# EAGLE design musIR-tiny-mk-1.0.4 (EAGLE 7.5.0)
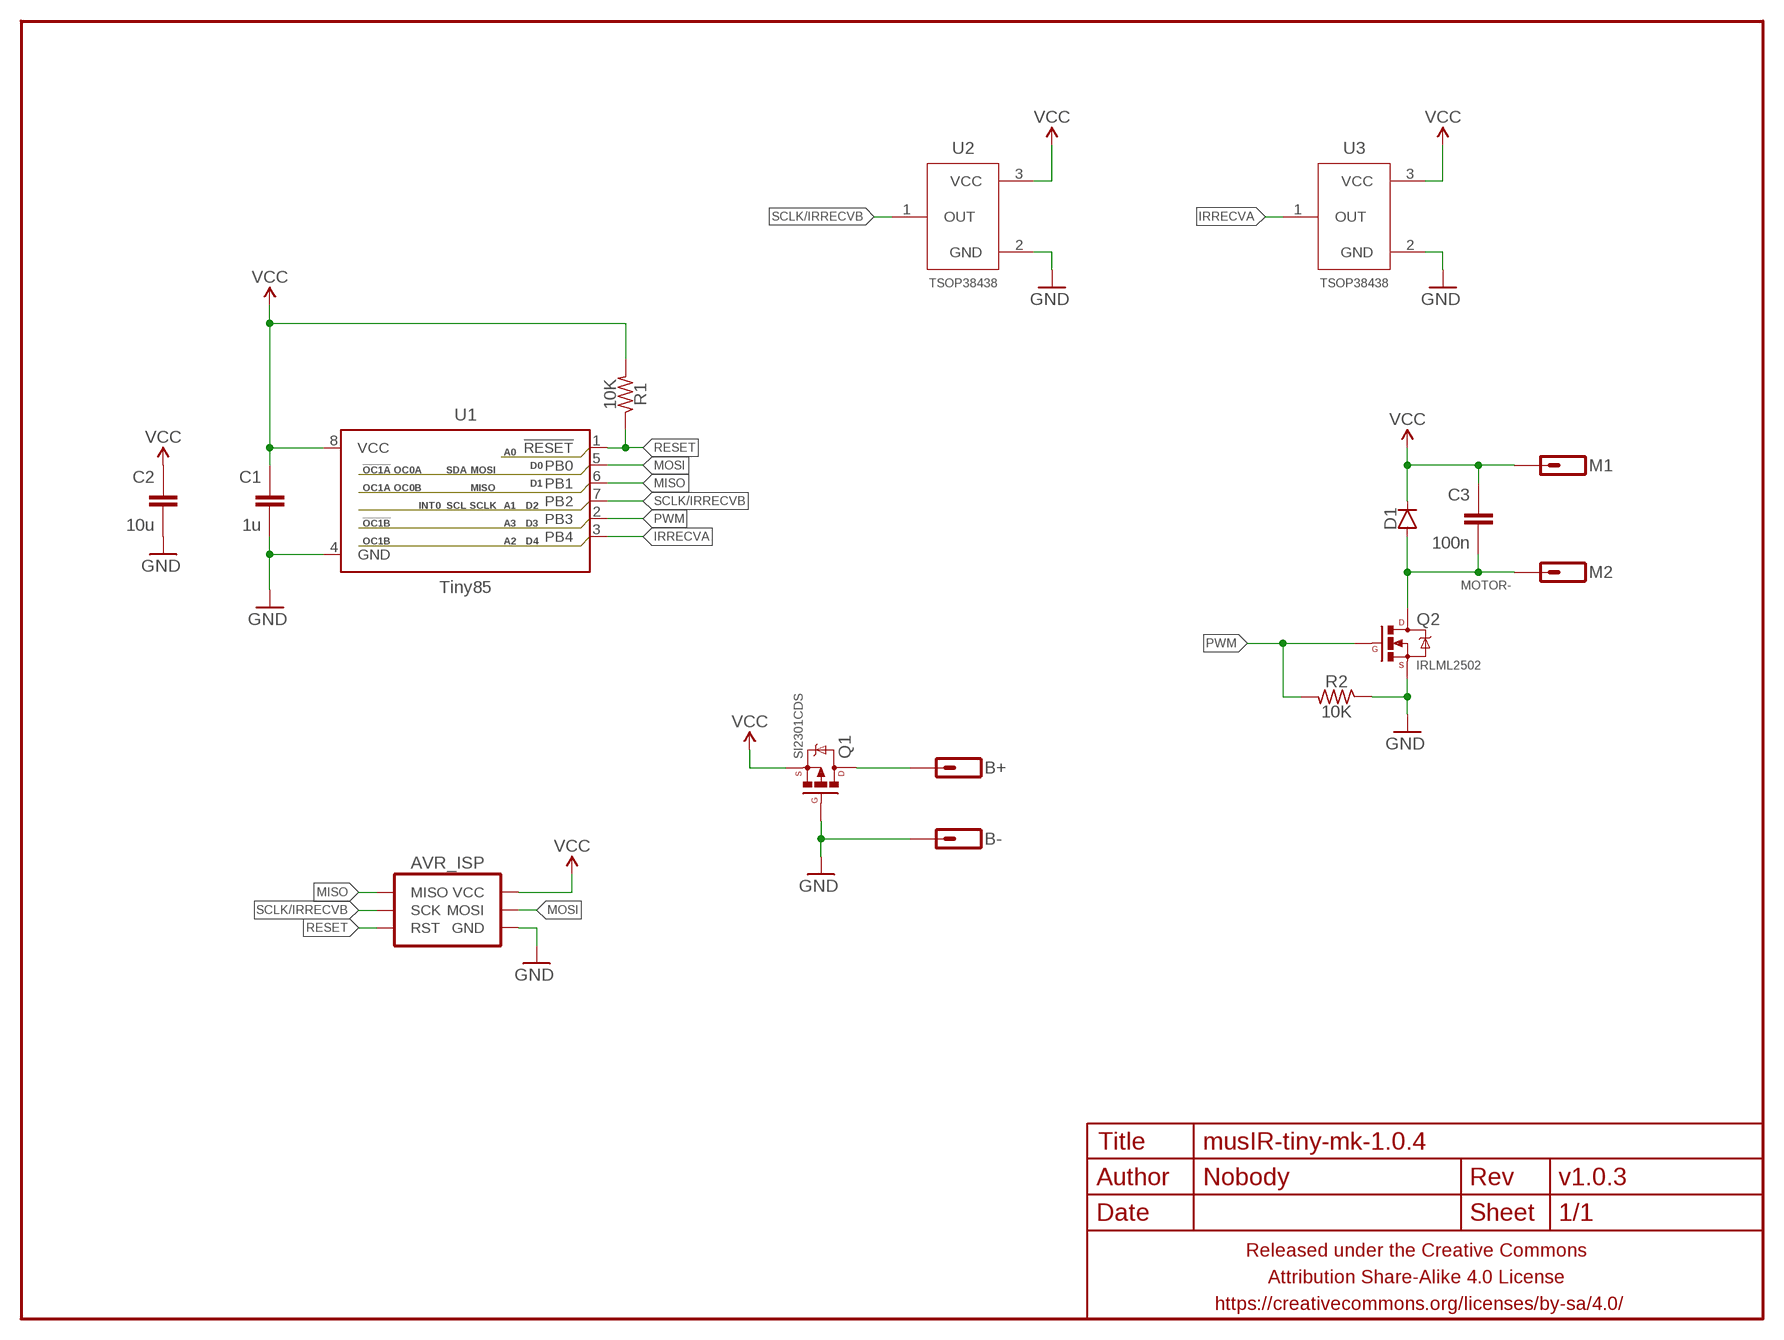
[diagram p0: schematic, sheet 1]

## Parts
AVR_ISP  AVR_SPI_PRG_6TESTPOINTS  [2X3_TEST_POINTS]
B+  M01PTH  [1X01]
B-  M01PTH  [1X01]
C1  1u  CAPACITOR-CERAMICC0603-TIGHTER  [C0603-TIGHTER]
C2  10u  CAPACITOR-CERAMICC0805-TIGHTER  [C0805-TIGHTER]
C3  100n  CAPACITOR-CERAMICC0603-TIGHTER  [C0603-TIGHTER]
D1  DIODESOD123  [SOD123]
FRAME1  FRAME-LETTERNO_PACKAGE  [DUMMY]
M1  M01PTH  [1X01]
M2  M01PTH  [1X01]
Q1  SI2301CDS  MOSFET-PCHANNELSOT-23  [SOT23]
Q2  IRLML2502  MOSFET-NCHANNELIRLML2502  [SOT23]
R1  10K  RESISTORR0603-TIGHTER  [R0603-TIGHTER]
R2  10K  RESISTORR0603-TIGHTER  [R0603-TIGHTER]
U1  Tiny85  ATTINY45TINY85-20-SOICW  [SO08-EIAJ]
U2  TSOP38438  TSOP382__/4__  [TSOP38238]
U3  TSOP38438  TSOP382__/4__  [TSOP38238]

## Nets
GND: AVR_ISP.6(GND) B-.1 C1.2 C2.2 Q1.1(G) Q2.2(S) R2.1 U1.4(GND) U2.2(GND) U3.2(GND)
IRRECVA: U1.3(PB4) U3.1(OUT)
MISO: AVR_ISP.1(MISO) U1.6(PB1)
MOSI: AVR_ISP.4(MOSI) U1.5(PB0)
MOTOR-: C3.2 D1.A M2.1 Q2.3(D)
N$1: B+.1 Q1.3(D)
PWM: Q2.1(G) R2.2 U1.2(PB3)
RESET: AVR_ISP.5(RST) R1.1 U1.1(!RESET)
SCLK/IRRECVB: AVR_ISP.3(SCK) U1.7(PB2) U2.1(OUT)
VCC: AVR_ISP.2(VCC) C1.1 C2.1 C3.1 D1.C M1.1 Q1.2(S) R1.2 U1.8(VCC) U2.3(VCC) U3.3(VCC)

## Library data of the parts
AVR_ISP = a_parts:AVR_SPI_PRG_6: AVR ISP 6 Pin This is the reduced ISP connector for AVR programming. Common on Arduino. This footprint will take up less PCB space and can be used with a 10-pin to 6-pin adapter such as SKU: BOB-08508 **Special note about "TEST_POINT" package. The stop mask is on the top side, so if you want your programming test points to be on the bottom of your board, make sure to place this package on the bottom side of the board. This also ensure that the orientation to program from the bottom side will be correct.
B+ B- M1 M2 = a_parts:M01: Header 1 Standard 1-pin 0.1" header. Use with straight break away headers (SKU : PRT-00116), right angle break away headers (PRT-00553), swiss pins (PRT-00743), machine pins (PRT-00117), and female headers (PRT-00115).
C1-C3 = a_parts:CAPACITOR-CERAMIC: CAPACITOR, European symbol
D1 = a_parts:DIODE: Diode These are standard reverse protection diodes and small signal diodes. SMA package can handle up to about 1A. SOD-323 can handle about 200mA. What the SOD-323 package when ordering, there are some mfgs out there that are 5-pin packages.
FRAME1 = a_parts:FRAME-LETTER: Schematic Frame Standard 8.5x11 US Letter frame; DESIGNER: Nobody; VERSION: v1.0.3
Q1 = a_parts:MOSFET-PCHANNEL: Generic PMOSFET IRLML2244 - TRANS-11153 (SOT-23 -20V -4.3A) (1.Gate 2.Source 3.Drain) FQP27P06 - COM-10349 <http://www.sparkfun.com/products/10349> (TO-220 -60V -27A) (1.Gate 2.Source 3.Drain)
Q2 = a_parts:MOSFET-NCHANNEL: Common NMOSFET Parts MFG P/N Store ID Prod ID FDD8780 TRANS-09984 SI7820DN TRANS-11055 FDS6630A IC-08089 2N7002PW TRANS-11151 FQP30N06L COM-10213 TRANS-10060 BSS123LT1G TRANS-08345 BSS138 TRANS-00830 BS170 2N7000
R1 R2 = a_parts:RESISTOR: RESISTOR, American symbol
U1 = a_parts:ATTINY45: Atmel 8-pin 2/4/8kB flash uC; PROD_ID: IC-09092; VALUE: Tiny85-20-SMT
U2 U3 = a_parts:TSOP382__/4__

## Board
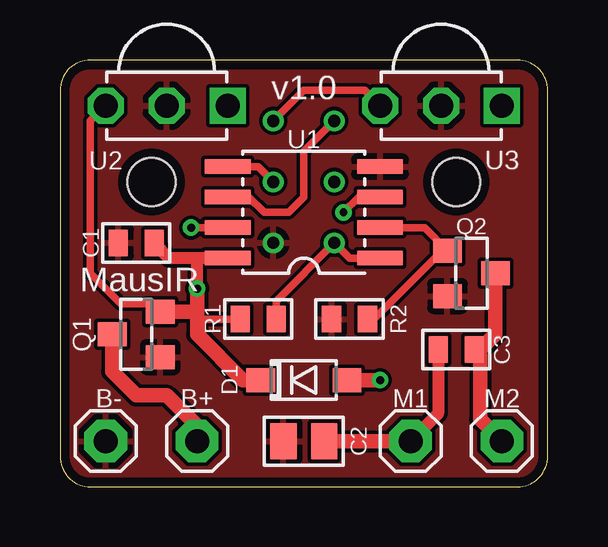
[diagram p1: board, top side]
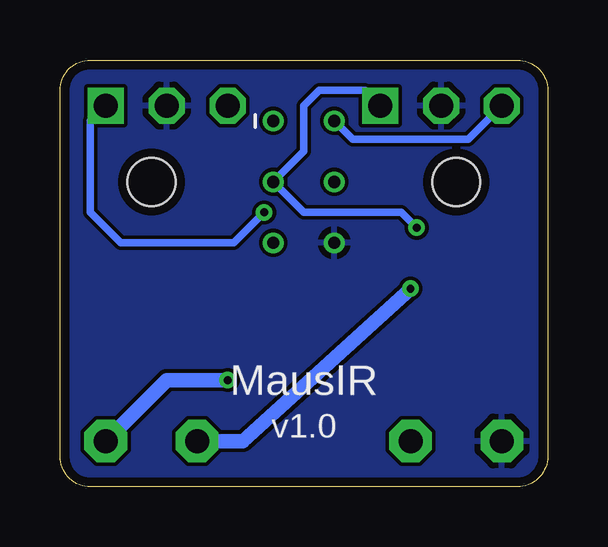
[diagram p2: board, bottom side, seen from below]

Size 20.32 x 17.78 mm. Coordinates in mm from the lower left corner, seen from the top.
Outline: 0,16.51 0,1.27 arc90 1.27,0 19.05,0 arc90 20.32,1.27 20.32,16.51 arc90 19.05,17.78 1.27,17.78 arc90 0,16.51
Copper layers (1*16): Top 0.0356mm / dielectric 1.5011mm / Bottom 0.0356mm
Design rules "LaenPCBOrder2": minimum track width 6mil, minimum drill 13mil, track to track 6mil, track to pad 6mil, pad to pad 6mil, via to via 6mil, smd to smd 6mil, copper to edge 15mil, drill to drill 6mil, minimum pad ring 7mil, minimum via ring 7mil, stop-mask expansion 3mil, vias tented up to drill 20mil, thermal gap 10mil
Holes 2 mm at 3.81,12.7 16.51,12.7

### Footprints (pad centres in the part's own frame; a part is rotated, then mirrored left to right if it is on the bottom)
2X3_TEST_POINTS = drill 0.508: 1 -2.54,-1.27; 2 -2.54,1.27; 3 0,-1.27; 4 0,1.27; 5 2.54,-1.27; 6 2.54,1.27
1X01 = drill 1 pad 1.778 octagon: 1 0,0
C0603-TIGHTER = smd 0.8 x 1.1: 1 -0.75,0; 2 0.75,0
C0805-TIGHTER = smd 1.1 x 1.5: 1 -0.85,0; 2 0.85,0
SOD123 = smd 1.2 x 1: A -1.8,0; C 1.8,0
SOT23 = smd 1 x 1.2: 1 -0.95,-1; 2 0.95,-1; 3 0,1
R0603-TIGHTER = smd 0.8 x 1.1: 1 -0.75,0; 2 0.75,0
SO08-EIAJ = smd 0.61 x 1.905: 1 -1.905,-3.175; 2 -0.635,-3.175; 3 0.635,-3.175; 4 1.905,-3.175; 5 1.905,3.175; 6 0.635,3.175; 7 -0.635,3.175; 8 -1.905,3.175
TSOP38238 = drill 1 square: 1 -2.54,0 | drill 1 octagon: 2 0,0; 3 2.54,0

### Placement (x,y rotation side)
AVR_ISP  10.16,12.7 270 bottom
B+  5.71,1.91 270 top
B-  1.91,1.91 90 top
C1  3.17,10.16 180 top
C2  10.16,1.91 180 top
C3  16.51,5.71 0 top
D1  10.16,4.45 180 top
FRAME1  0,0 0 top
M1  14.61,1.91 0 top
M2  18.41,1.91 0 top
Q1  3.17,6.35 90 top
Q2  17.14,8.89 270 top
R1  8.26,6.99 180 top
R2  12.06,6.99 0 top
U1  10.16,11.43 90 top
U2  4.45,15.88 180 top
U3  15.88,15.88 180 top

### Tracks (layer width: path | path; a pad name or v marks a point on that pad's centre or on a via)
GND
  pour Top (rank 6): 0,16.51 0,1.27 arc90 1.27,0 19.05,0 arc90 20.32,1.27 20.32,16.51 arc90 19.05,17.78 1.27,17.78 arc90
  pour Bottom (rank 6): 0,16.51 0,1.27 arc90 1.27,0 19.05,0 arc90 20.32,1.27 20.32,16.51 arc90 19.05,17.78 1.27,17.78 arc90
IRRECVA  (via drill 0.33)
  Top 0.305: U1.3 12.45,12.06 v11.81,11.43
  Bottom 0.305: v11.81,11.43 13.08,10.16 17.78,10.16 19.05,11.43 19.05,15.24 U3.1
MISO
  Top 0.305: U1.6 7.87,12.06 8.51,11.43 9.53,11.43 10.16,12.06 10.16,13.97 AVR_ISP.1
MOSI
  Top 0.305: U1.5 8.26,13.34 AVR_ISP.4
MOTOR-  (via drill 0.33)
  Top 0.508: C3.2 17.51,5.71
  Top 0.61: D1.A v13.34,4.45 | M2.1 17.51,2.81 17.51,5.71 18.14,6.35 Q2.3
  Bottom 0.61: v13.34,4.45 15.88,4.45 M2.1
N$1
  Top 0.61: Q1.3 2.17,4.81 3.17,3.81 4.45,3.81 5.71,2.54 B+.1
PWM
  Top 0.305: U1.2 15.19,10.79 Q2.1 15.94,9.84 13.08,6.99 R2.2
RESET
  Top 0.305: R1.1 9.01,7.74 AVR_ISP.5 12.06,9.53 U1.1
SCLK/IRRECVB  (via drill 0.33)
  Top 0.305: U1.7 v5.46,10.79
  Bottom 0.305: U2.1 7.62,16.51 9.53,16.51 10.16,15.88 10.16,13.97 AVR_ISP.3 10.16,11.43 6.1,11.43 v5.46,10.79
VCC  (via drill 0.33)
  Top 0.305: R1.2 5.71,6.99 | U2.3 1.27,15.24 1.27,8.89 2.54,7.62 3.85,7.62 Q1.2 | AVR_ISP.2 10.16,16.51 12.7,16.51 U3.3
  Top 0.508: U1.8 5.71,9.53 | 5.71,9.53 4.56,9.53 C1.1 | C3.1 15.76,3.06 M1.1 | v5.71,8.26 5.71,9.53
  Top 0.61: C2.1 M1.1 | v5.71,8.26 5.71,7.49 | 5.71,7.49 5.71,6.99 5.71,6.35 7.62,4.45 D1.C | Q1.2 5.52,7.3 5.71,7.49
  Bottom 0.305: AVR_ISP.2 8.13,14.48 3.3,14.48 U2.3
  Bottom 0.61: v5.71,8.26 12.7,1.91 M1.1

### Text on the board
tPlace: MausIR
bPlace: MausIR